# Altium project sender.PrjPcb
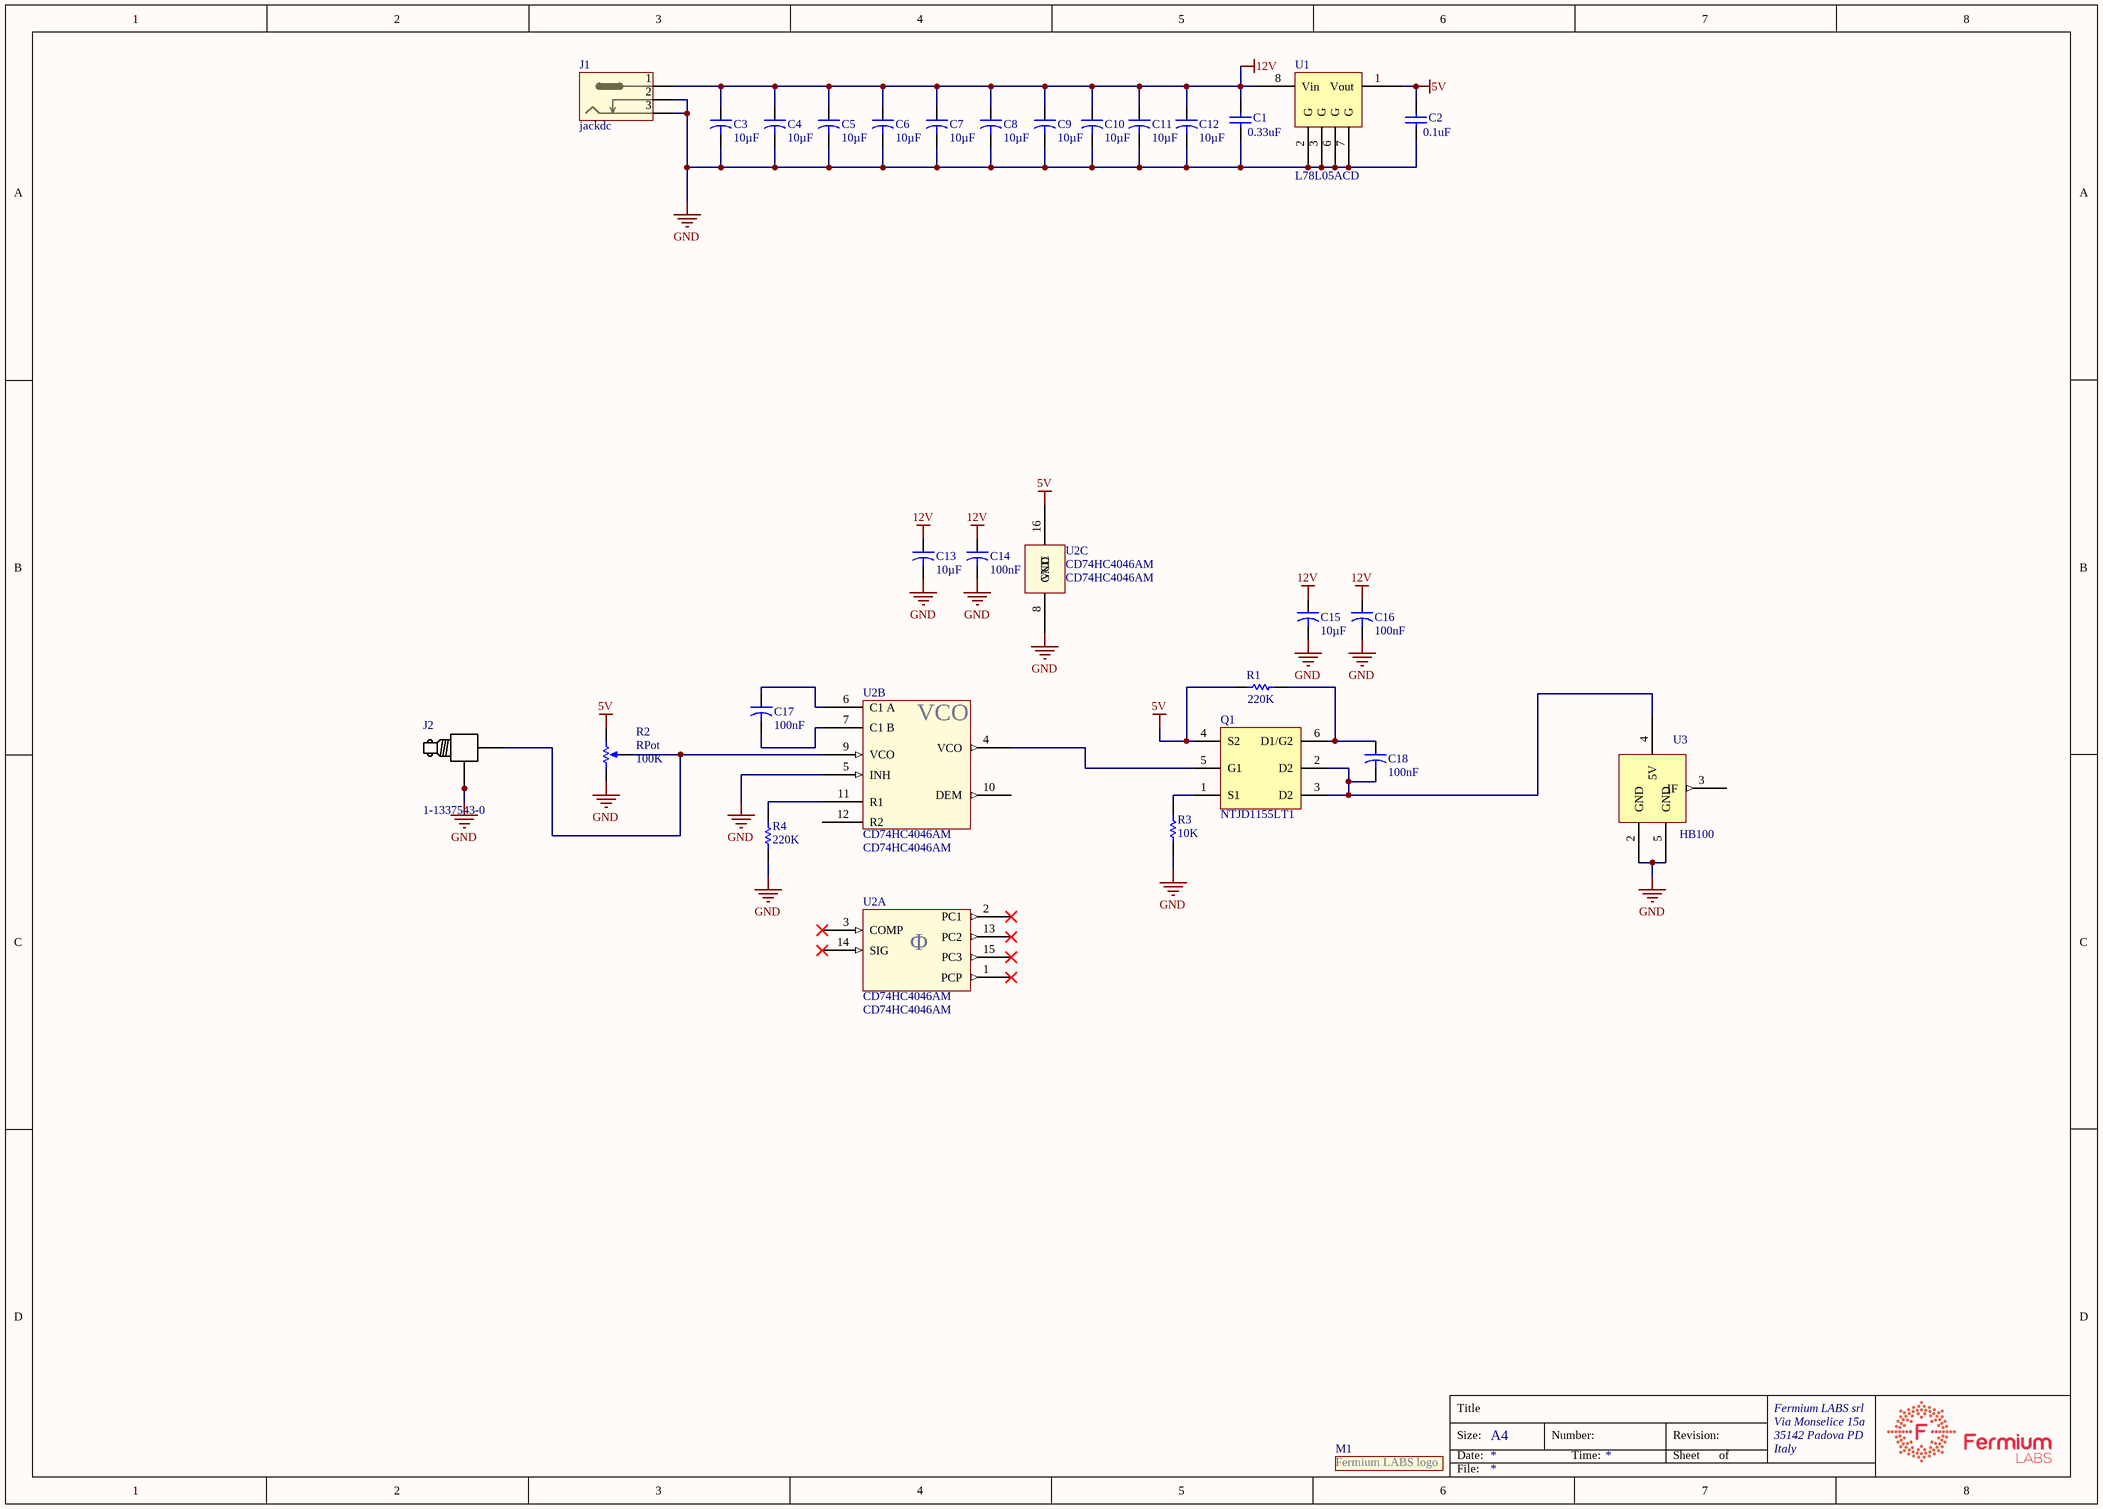
[diagram p0: sender.SchDoc]
1 sheet, 29 parts. Net scope: global (net labels, ports and power ports of the same name join across sheets).

## Sheet sender.SchDoc
size A3; Organization: Altium Limited; Address1: L3, 12a Rodborough Rd; Address2: Frenchs Forest; Address3: NSW; Address4: Australia 2086

### Parts
C1  value 0.33uF  [RAD-0.3]
C2  value 0.1uF  [RAD-0.3]
C3  Capacitance: 10µF  [CAP 1206/3216]
C4  Capacitance: 10µF  [CAP 1206/3216]
C5  Capacitance: 10µF  [CAP 1206/3216]
C6  Capacitance: 10µF  [CAP 1206/3216]
C7  Capacitance: 10µF  [CAP 1206/3216]
C8  Capacitance: 10µF  [CAP 1206/3216]
C9  Capacitance: 10µF  [CAP 1206/3216]
C10  Capacitance: 10µF  [CAP 1206/3216]
C11  Capacitance: 10µF  [CAP 1206/3216]
C12  Capacitance: 10µF  [CAP 1206/3216]
C13  Capacitance: 10µF  [CAP 1206/3216]
C14  Capacitance: 100nF  [CAP 0805/2012]
C15  Capacitance: 10µF  [CAP 1206/3216]
C16  Capacitance: 100nF  [CAP 0805/2012]
C17  Capacitance: 100nF  [CAP 0805/2012]
C18  Capacitance: 100nF  [CAP 0805/2012]
J1  jackdc  [dc-jack]
J2  Supplier Part Number 1: 1-1337543-0  [BNC-RA]
M1  fermiumlabs-logo  [frm-small]  (value not drawn)
Q1  NTJD1155LT1  [ONSC-SC70-6-419B-02_W_V]
R1  value 220K  [RES 0805/2012]  (hidden comment: Res1)
R2  RPot  value 100K  [VR5]
R3  value 10K  [AXIAL-0.3]  (hidden comment: Res1)
R4  value 220K  [RES 0805/2012]  (hidden comment: Res1)
U1  L78L05ACD  [ST SOIC-8N]
U2  CD74HC4046AM  [SO16]  (parts A,B,C of 3)
U3  HB100  [HB100]

### Nets
5V: C2.2 Q1.4(S2) R1.1 R2.2(BOT) U1.1(Vout) U2.16(VCC)
12V: C1.2 C3.1 C4.1 C5.1 C6.1 C7.1 C8.1 C9.1 C10.1 C11.1 C12.1 C13.1 C14.1 C15.1 C16.1 J1.1 U1.8(Vin)
GND: C1.1 C2.1 C3.2 C4.2 C5.2 C6.2 C7.2 C8.2 C9.2 C10.2 C11.2 C12.2 C13.2 C14.2 C15.2 C16.2 J1.2 J1.3 J2.2(gnd) J2.A J2.B R2.1(TOP) R3.2 R4.1 U1.2(G) U1.3(G) U1.6(G) U1.7(G) U2.5(INH) U2.8(GND) U3.2(GND) U3.5(GND)
NetC17_1: C17.1 U2.6(C1_A)
NetC17_2: C17.2 U2.7(C1_B)
NetC18_1: C18.1 Q1.6(D1/G2) R1.2
NetC18_2: C18.2 Q1.2(D2) Q1.3(D2) U3.4(5V)
NetJ2_1: J2.1 R2.3(TAP) U2.9(VCO)
NetQ1_1: Q1.1(S1) R3.1
NetQ1_5: Q1.5(G1) U2.4(VCO)
NetR4_2: R4.2 U2.11(R1)

Not connected (* = marked no-connect by the designer): U2 1(PCP)* 2(PC1)* 3(COMP)* 10(DEM) 12(R2) 13(PC2)* 14(SIG)* 15(PC3)*; U3 3(IF)

### Notes on the sheet
- Title
- Size:
- Date:
- A4
- Number:
- Time:
- Revision:
- Sheet
- of
- Fermium LABS srl
- Via Monselice 15a
- 35142 Padova PD
- Italy
- File:
- (in symbol CD74HC4046AM, part A) Φ
- (in symbol fermiumlabs-logo) Fermium LABS logo

### Library data of the parts
C1 C2 = Cap: Capacitor; Published: 8-Jun-2000; LatestRevisionDate: 17-Jul-2002; LatestRevisionNote: Re-released for DXP Platform.; PackageReference: RAD-0.3; Publisher: Altium Limited; PackageDescription: Radial Cap, Thru-Hole; 2 Leads; 0.3 in Pin Spacing
C3-C13 C15 = Cap2: Capacitor; Manufacturer: SAMSUNG; Manufacturer Part Number: CL31A106KAHNNNE; Unit: pcs; SuppliedAmount: 0; MinAmount: 100; Capacitor type: ceramic; Capacitor kind: MLCC; Operating voltage: 25V; Dielectric: X5R; Tolerance: ±10%; Case - inch: 1206; Case - mm: 3216; Pads: 2 SMD; Published: 23-Sep-2002; PackageReference: CAPR5-4X5; Publisher: Altium Limited; PackageDescription: 1206; Supplier 1: TME; Supplier Part Number 1: CL31A106KAHNNNE; Category: 1206 MLCC SMD Capacitors; Stock 1: 279700; Pricing 1: 100=0.0248, 300=0.0203, 1000=0.0167, 2000=0.0131, 10000=0.0127 (EUR); Weight: 0.061; Multiples: 100; Mounting: SMD; Operating temperature: -55...85°C; Price Type: NET; ComponentLink1URL: http://static.tme.eu/products_pics/b/e/9/be9e0dd298dcf4979ea1dd3d226e0bfa/58780.jpg; ComponentLink1Description: http://static.tme.eu/products_pics/b/e/9/be9e0dd298dcf4979ea1dd3d226e0bfa/58780.jpg
C14 C16-C18 = Cap2: Capacitor; Manufacturer: YAGEO; Manufacturer Part Number: CC0805JRX7R9BB104; Unit: pcs; SuppliedAmount: 0; MinAmount: 100; Capacitor type: ceramic; Capacitor kind: MLCC; Operating voltage: 50V; Dielectric: X7R; Tolerance: ±5%; Case - inch: 0805; Case - mm: 2012; Pads: 2 SMD; Supplier 1: TME; Supplier Part Number 1: CC0805JRX7R9104; Category: 0805 MLCC SMD Capacitors; Stock 1: 89911; Pricing 1: 100=0.00613, 300=0.00464, 1000=0.00342, 4000=0.00284, 20000=0.00273 (EUR); Weight: 0.042; Multiples: 100; Mounting: SMD; Price Type: NET; ComponentLink1URL: http://static.tme.eu/products_pics/d/b/b/dbbd93eaf25225110ca26eb66da77328/58538.jpg; ComponentLink1Description: http://static.tme.eu/products_pics/d/b/b/dbbd93eaf25225110ca26eb66da77328/58538.jpg
J2 = BNC-PCB-RA: connector bnc; Manufacturer: TE CONNECTIVITY; Unit: pcs; SuppliedAmount: 0; MinAmount: 1; Connector: socket; Connector variant: insulated; Spatial orientation: angled 90°; Wave impedance: 50Ω; Electrical mounting: THT; Mechanical mounting: on PCBs; Insulator material: polyester; Pads: 4 THT; Supplier 1: TME; Manufacturer Part Number: 1-1337543-0; Category: BNC connectors; Stock 1: 44; Pricing 1: 1=1.22, 25=1.1, 100=0.98, 1000=0.86 (EUR); Weight: 13.22; Multiples: 1; Connector type: BNC; Contact plating: gold plated; Price Type: NET; ComponentLink1URL: http://static.tme.eu/products_pics/6/3/2/63240353f8a8790dbe8f7bd93b014c1a/378606.jpg; ComponentLink1Description: http://static.tme.eu/products_pics/6/3/2/63240353f8a8790dbe8f7bd93b014c1a/378606.jpg
Q1 = NTJD1155LT1: Power MOSFET, 8 V, +/- 1.3 A, High Side Load Switch with Level-Shift, P-Channel, 6-Pin SC70, Tape and Reel; Manufacturer: On Semiconductor; Channel Polarity: P Channel; Configuration: Dual; ID Max (A): 1.3; V(BR)DSS Min (V): 8; VGS(th) Max (V): 1; DatasheetVersion: Rev. 5; PackageVersion: Rev. W; PackageReference: SC70-6-419B-02_W; PackageDescription: 6-Pin Small Outline Transistor, Body 2 x 1.25 mm, Pitch 0.65 mm; Package Type: SC-88-6 / SC-70-6 / SOT-363-6; Packing: Tape and Reel; Mounting Technology: Surface Mount; PartNumber: NTJD1155LT1; ComponentLink1Description: Manufacturer URL; ComponentLink1URL: http://www.onsemi.com/; ComponentLink2Description: Datasheet; ComponentLink2URL: http://www.onsemi.com/pub_link/Collateral/NTJD1155L-D.PDF; ComponentLink3Description: Package Specification; ComponentLink3URL: http://www.onsemi.com/pub_link/Collateral/SMF05C-D.PDF
R1 R4 = Res1: Resistor; Manufacturer: Royal Electronic Factory; Manufacturer Part Number: 0805S8J0224T5E; Supplier 1: TME; Supplier Part Number 1: SMD0805-220K; Stock 1: 102100; Pricing 1: 100=0.0065, 1000=0.0025, 5000=0.0009, 15000=0.0008, 50000=0.0008 (USD)
R2 = RPot: Potentiometer; Supplier 1: TME; Supplier Part Number 1: R16148-1A-2-A100K
R3 = Res1: Resistor; Published: 8-Jun-2000; LatestRevisionDate: 17-Jul-2002; LatestRevisionNote: Re-released for DXP Platform.; PackageReference: AXIAL-0.3; Publisher: Altium Limited; PackageDescription: Axial Device, Thru-Hole; 2 Leads; 0.3 in Pin Spacing
U3 = HB100: Manufacturer: China unspecified; Manufacturer Part Number: HB100; Supplier 1: Alibaba; Supplier Part Number 1: HB100
U1 = L78L05ACD: Supplier 1: TME; Supplier Part Number 1: L78L05ACD
U2 = CD74HC4046AM: Supplier 1: TME; Supplier Part Number 1: CD74HC4046AM